# EAGLE design celly_jamjam (EAGLE 6.5.0)
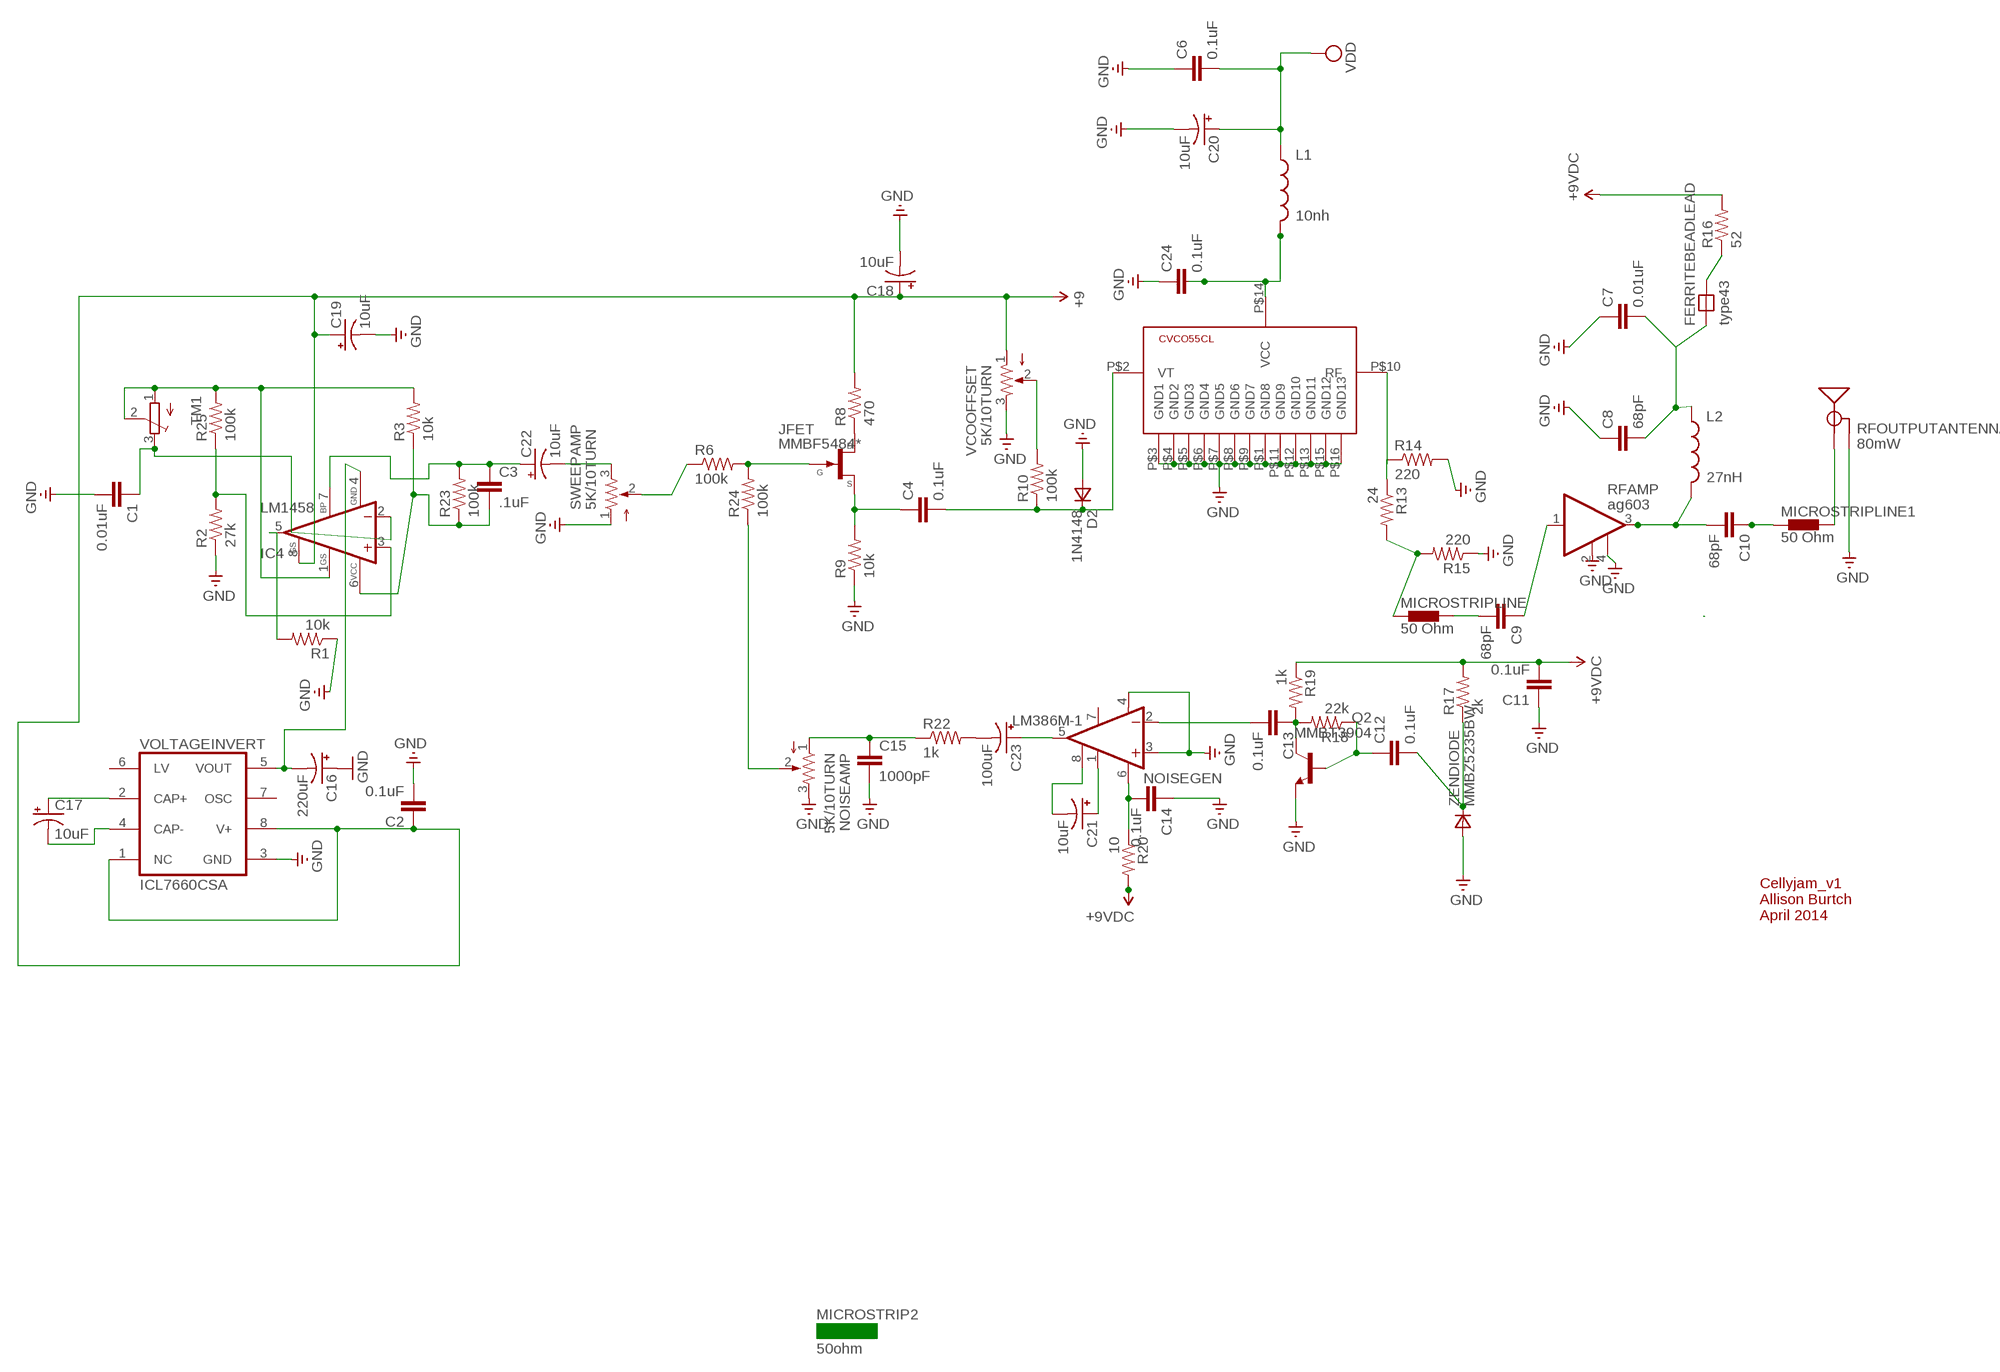
[diagram p0: schematic, sheet 1]

## Parts
C1  0.01uF  CAP0603-CAP  [0603-CAP]
C2  0.1uF  CAP0603-CAP  [0603-CAP]
C3  .1uF  CAP0603-CAP  [0603-CAP]
C4  0.1uF  CAP0603-CAP  [0603-CAP]
C6  0.1uF  CAP0603-CAP  [0603-CAP]
C7  0.01uF  CAP0603-CAP  [0603-CAP]
C8  68pF  CAP0603-CAP  [0603-CAP]
C9  68pF  CAP0603-CAP  [0603-CAP]
C10  68pF  CAP0603-CAP  [0603-CAP]
C11  0.1uF  CAP0603-CAP  [0603-CAP]
C12  0.1uF  CAP0603-CAP  [0603-CAP]
C13  0.1uF  CAP0603-CAP  [0603-CAP]
C14  0.1uF  CAP0603-CAP  [0603-CAP]
C15  1000pF  CAP0603-CAP  [0603-CAP]
C16  220uF  CAP_POLD  [PANASONIC_D]
C17  10uF  CAP_POLC  [PANASONIC_C]
C18  10uF  CAP_POLC  [PANASONIC_C]
C19  10uF  CAP_POLC  [PANASONIC_C]
C20  10uF  CAP_POLC  [PANASONIC_C]
C21  10uF  CAP_POLC  [PANASONIC_C]
C22  10uF  CAP_POLC  [PANASONIC_C]
C23  100uF  CAP_POLD  [PANASONIC_D]
C24  0.1uF  CAP0603-CAP  [0603-CAP]
D2  1N4148  DSOD323  [SOD323]
FERRITEBEADLEAD  type43  FB-226  [FB-226]
IC4  LM1458  LM386M  [SO08]
JFET  MMBF5484*  MMBF5484  [SOT23]
L1  10nh  INDUCTOR0603  [0603]
L2  27nH  INDUCTOR0603  [0603]
MICROSTRIPLINE  50 Ohm  BLM15HB121SN1  [0402]
MICROSTRIPLINE1  50 Ohm  BLM15HB121SN1  [0402]
NOISEAMP  5K/10TURN  P160KN  [P160KN]
NOISEGEN  LM386M-1  [SO08@1]
Q2  MMBT3904  [SOT23-BEC]
R1  10k  RESISTOR0603-RES  [0603-RES]
R2  27k  RESISTOR0603-RES  [0603-RES]
R3  10k  RESISTOR0603-RES  [0603-RES]
R6  100k  RESISTOR0603-RES  [0603-RES]
R8  470  RESISTOR0603-RES  [0603-RES]
R9  10k  RESISTOR0603-RES  [0603-RES]
R10  100k  RESISTOR0603-RES  [0603-RES]
R13  24  RESISTOR0603-RES  [0603-RES]
R14  220  RESISTOR0603-RES  [0603-RES]
R15  220  RESISTOR0603-RES  [0603-RES]
R16  52  RESISTOR0603-RES  [0603-RES]
R17  2k  RESISTOR0603-RES  [0603-RES]
R18  22k  RESISTOR0603-RES  [0603-RES]
R19  1k  RESISTOR0603-RES  [0603-RES]
R20  10  RESISTOR0603-RES  [0603-RES]
R22  1k  RESISTOR0603-RES  [0603-RES]
R23  100k  RESISTOR0603-RES  [0603-RES]
R24  100k  RESISTOR0603-RES  [0603-RES]
R25  100k  RESISTOR0603-RES  [0603-RES]
RFAMP  ag603  LEE-39+  [FG873]
RFOUTPUTANTENNA  80mW  ANTENNASMD1  [ANTENNA-CHIP]
SWEEPAMP  5K/10TURN  P160KN  [P160KN]
TM1  TRIMPOTTC33X  [TC33X]
U$1  CVCO55CL  [CVCO55CL]
VCOOFFSET  5K/10TURN  P160KN  [P160KN]
VOLTAGEINVERT  ICL7660CSA  [SO08]
ZENDIODE  MMBZ5235BW  DSOD323  [SOD323]

## Nets
GND: C1.2 C2.2 C6.1 C7.1 C8.1 C11.1 C14.1 C15.2 C16.+ C18.- C19.- C20.- C24.1 D2.2(A) NOISEAMP.3 NOISEGEN.3(+IN) NOISEGEN.4(GND) Q2.E R1.1 R2.1 R9.1 R14.2 R15.1 RFAMP.2(GND) RFAMP.4(GND) RFOUTPUTANTENNA.GND SWEEPAMP.1 U$1.P$1(GND8) U$1.P$3(GND1) U$1.P$4(GND2) U$1.P$5(GND3) U$1.P$6(GND4) U$1.P$7(GND5) U$1.P$8(GND6) U$1.P$9(GND7) U$1.P$11(GND9) U$1.P$12(GND10) U$1.P$13(GND11) U$1.P$15(GND12) U$1.P$16(GND13) VCOOFFSET.3 VOLTAGEINVERT.3(GND) ZENDIODE.2(A)
N$2: C7.2 C8.2 FERRITEBEADLEAD.1 L2.1
N$3: U$1.P$10(RF)
N$4: C17.+ VOLTAGEINVERT.2(CAP+)
N$5: C17.- VOLTAGEINVERT.4(CAP-)
N$6: C21.+ NOISEGEN.1(GAIN)
N$7: C16.- IC4.4(GND) VOLTAGEINVERT.5(VOUT)
N$8: IC4.1(GAIN) R3.2 R25.2 TM1.1(A) TM1.2(S)
N$10: C1.1 IC4.2(-IN) TM1.3(E)
N$11: R6.1 SWEEPAMP.2
N$12: C22.- SWEEPAMP.3
N$14: C3.2 IC4.6(VS) R3.1 R23.1
N$15: C21.- NOISEGEN.8(GAIN)
N$16: C12.1 Q2.B R18.1
N$17: C10.1 MICROSTRIPLINE1.1
N$18: C13.2 NOISEGEN.2(-IN)
N$19: C13.1 Q2.C R18.2 R19.2
N$20: C12.2 R17.1 ZENDIODE.1(C)
N$21: C23.- R22.2
N$22: C23.+ NOISEGEN.5(OUT)
N$23: C15.1 NOISEAMP.1 R22.1
N$24: C3.1 C22.+ IC4.7(BS2) R23.2
N$25: NOISEAMP.2 R24.1
N$26: C14.2 NOISEGEN.6(VS) R20.1
N$27: JFET.1(D) R8.1
N$28: MICROSTRIPLINE.1 R13.2 R15.2
N$29: R13.1 R14.1
N$30: C4.1 JFET.2(S) R9.2
N$31: R10.2 VCOOFFSET.2
N$32: C4.2 D2.1(C) R10.1 U$1.P$2(VT)
N$33: C9.1 RFAMP.1(IN)
N$34: C10.2 L2.2 RFAMP.3(OUT)
N$35: C9.2 MICROSTRIPLINE.2
N$36: FERRITEBEADLEAD.2 R16.1
N$37: C24.2 L1.2 U$1.P$14(VCC)
N$40: MICROSTRIPLINE1.2 RFOUTPUTANTENNA.FEED(SIGNAL)
N$47: JFET.3(G) R6.2 R24.2
N$48: IC4.5(OUT) R1.2
N$49: IC4.3(+IN) R2.2 R25.1
VCC: C2.1 C11.2 C18.+ C19.+ IC4.8(GAIN) R8.2 R16.2 R17.2 R19.1 R20.2 VCOOFFSET.1 VOLTAGEINVERT.1(NC) VOLTAGEINVERT.8(V+) ; supply symbol labelled +9VDC, +9
VDD: C6.2 C20.+ L1.1
Unconnected: NOISEGEN.7(BYPASS) VOLTAGEINVERT.6(LV) VOLTAGEINVERT.7(OSC)

## Notes on the sheet
- Cellyjam_v1
  Allison Burtch 
  April 2014

## Library data of the parts
C1-C4 C6-C15 C24 = SparkFun-Passives:CAP: Capacitor Standard 0603 ceramic capacitor, and 0.1" leaded capacitor.
C16-C23 = SparkFun-Capacitors:CAP_POL: Capacitor Polarized These are standard SMD and PTH capacitors. Normally 10uF, 47uF, and 100uF in electrolytic and tantalum varieties. Always verify the external diameter of the through hole cap, it varies with capacity, voltage, and manufacturer. The EIA devices should be standard.
D2 ZENDIODE = zetex:D: DIODE; MPN: CDSOD323-T05C; OC_FARNELL: 1824860; OC_NEWARK: 79R6078
FERRITEBEADLEAD = inductor-jwmiller:FB: FERRITE BEAD
IC4 = linear:LM386: Low Voltage Audio Power Amplifier
JFET = transistor-fet:MMBF5484*: N-Channel JFET
L1 L2 = SparkFun-Passives:INDUCTOR: Inductors Basic Inductor/Choke - 0603 and 1206. Footprints are not proven and vary greatly between part numbers. SRN6045- 33uH, 20% 1.4A SDR0403-560KL - 56uH, 10%, 500mA RMS/740mA peak
MICROSTRIPLINE MICROSTRIPLINE1 = inductors:BLM15H: EMIFIL (R) Chip Ferrite Bead for GHz Noise Source: http://www.murata.com/ Ferrite Bead BLM15H.pdf
NOISEAMP SWEEPAMP VCOOFFSET = pot:P160KN: POTENTIOMETER - 11 mm 6 mm shaft, 18 teeth knurl
NOISEGEN = linear:LM386?-*: Low Voltage Audio Power Amplifier Source: http://cache.national.com/ds/LM/LM386.pdf
Q2 = transistor-npn:MMBT3904*: NPN TRANSISTOR
R1-R3 R6 R8-R10 R13-R20 R22-R25 = SparkFun-Resistors:RESISTOR: Resistor Basic schematic elements and footprints for 0603, 1206, and PTH resistors.
RFAMP = mini-circuits:LEE-39+: Monolithic RF Amplifier
RFOUTPUTANTENNA = SparkFun-RF:ANTENNA: Chip antenna Chip antenna with ground or secondary connection. Common with larger metal RF connectors.
TM1 = adafruit:TRIMPOT: SMT trimmer potentiometer part number TC33X http://www.ladyada.net/library/eagle
U$1 = crystec_vco:CVCO55CL: Volatage Controlled Oscillator - VCO Vendor: CRYSTEK MICROWAVE Series: CVCO-55CL
VOLTAGEINVERT = maxim:ICL7660CSA: VOLTAGE CONVERTER; MF: MAXIM; MPN: ICL7660CSA; OC_FARNELL: 9724710; OC_NEWARK: 34C3732

## Board
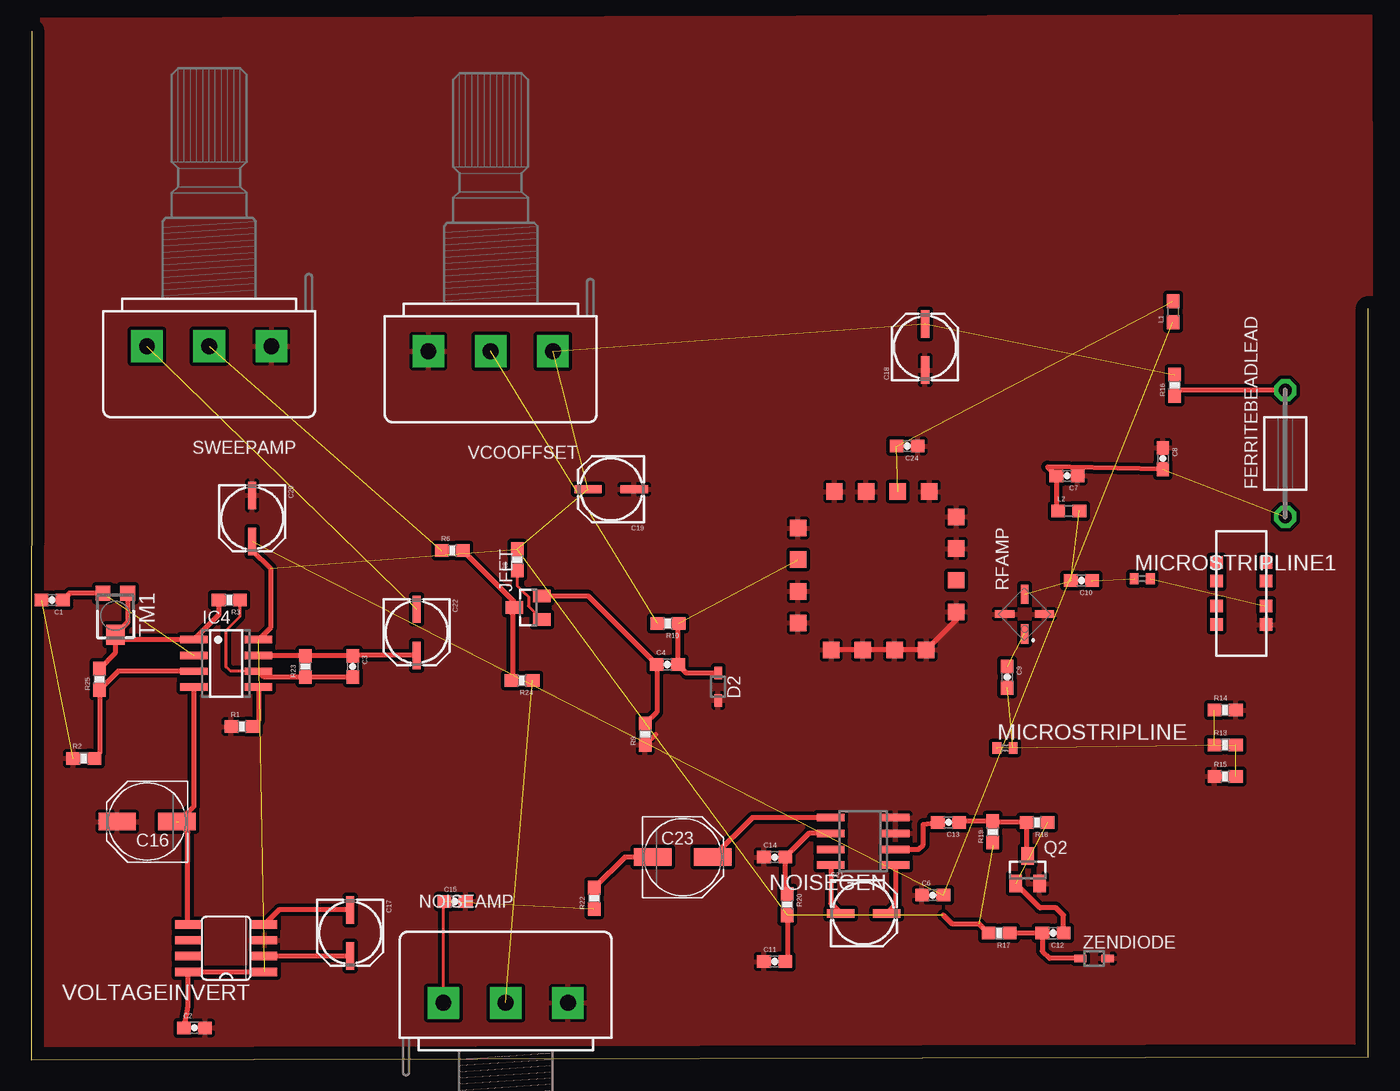
[diagram p1: board, top side]
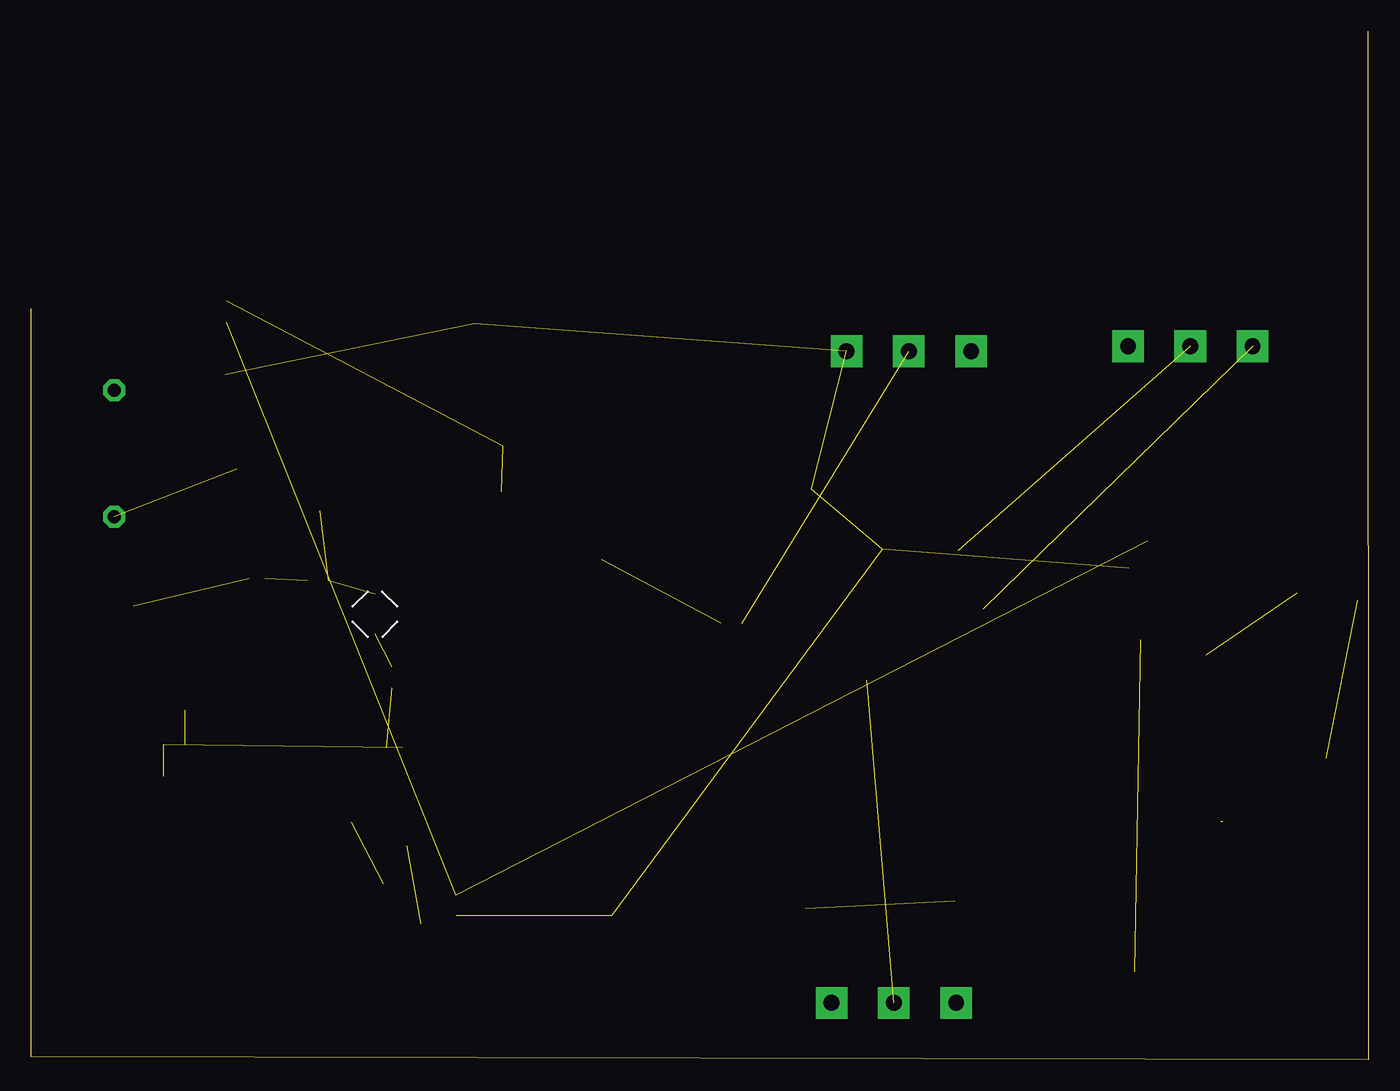
[diagram p2: board, bottom side, seen from below]

Size 107.37 x 82.55 mm. Coordinates in mm from the lower left corner, seen from the top.
Outline: 107.37,60.25 107.37,0.25 0,0 0.05,82.55
Copper layers (1*16): Top 0.035mm / dielectric 1.5mm / Bottom 0.035mm
Design rules "default": minimum track width 10mil, minimum drill 24mil, track to track 8mil, track to pad 8mil, pad to pad 8mil, via to via 8mil, smd to smd 8mil, copper to edge 40mil, drill to drill 8mil, minimum pad ring 10mil, minimum via ring 8mil, stop-mask expansion 4mil, vias tented up to drill 0mil, thermal gap 10mil

### Footprints (pad centres in the part's own frame; a part is rotated, then mirrored left to right if it is on the bottom)
0603-CAP = smd 1.1 x 1: 1 -0.85,0; 2 0.85,0
PANASONIC_D = smd 3 x 1.4: + 2.4,0; - -2.4,0
PANASONIC_C = smd 2.2 x 0.65: + 1.9,-0.2; - -1.8,-0.2
SOD323 = smd 1 x 0.6: 1 -1.1,0; 2 1.1,0
FB-226 = drill 1.016 pad 1.778 octagon: 1 -5.08,0; 2 5.08,0
SO08 = smd 0.6 x 2.2: 1 -1.905,-2.6; 2 -0.635,-2.6; 3 0.635,-2.6; 4 1.905,-2.6; 5 1.905,2.6; 6 0.635,2.6; 7 -0.635,2.6; 8 -1.905,2.6
SOT23 = smd 1 x 1.4: 1 -0.95,-1.1; 2 0.95,-1.1; 3 0,1.1
0603 = smd 1.1 x 1: 1 -0.85,0; 2 0.85,0
0402 = smd 0.7 x 0.9: 1 -0.65,0; 2 0.65,0
P160KN = drill 1.27 pad 2.54 square: 1 -3.8,-5; 2 -3.8,0; 3 -3.8,5
SO08@1 = smd 0.6 x 2.2: 1 -1.905,-2.6; 2 -0.635,-2.6; 3 0.635,-2.6; 4 1.905,-2.6; 5 1.905,2.6; 6 0.635,2.6; 7 -0.635,2.6; 8 -1.905,2.6
SOT23-BEC = smd 1 x 1.4: B -0.95,-1.1; C 0,1.1; E 0.95,-1.1
0603-RES = smd 1.1 x 1: 1 -0.85,0; 2 0.85,0
FG873 = smd 1.549 x 0.61: 1 -1.587,0; 3 1.587,0 | smd 0.61 x 1.549: 2 0,-1.587; 4 0,1.587
ANTENNA-CHIP = smd 1 x 1: 3 1,-2; 4 2.5,-2; 5 2.5,2; 6 1,2; 7 -1,2; 8 -2.5,2; FEED -1,-2; GND -2.5,-2
TC33X = smd 1.2 x 1.2: 1 -1,-1.825; 3 1,-1.825 | smd 1.5 x 1.6: 2 0,1.5
CVCO55CL = smd 1.32 x 1.32: P$1 2.921,0; P$2 5.461,0; P$3 8.001,0; P$4 10.541,0; P$5 12.7,2.667; P$6 12.7,5.207; P$7 12.7,7.747; P$8 12.7,10.287; P$9 9.652,12.7; P$10 7.112,12.7; P$11 4.572,12.7; P$12 2.032,12.7; P$13 0,10.541; P$14 0,8.001; P$15 0,5.461; P$16 0,2.921
SO08' = smd 0.66 x 2.032: 1 -1.905,-3.073; 2 -0.635,-3.073; 3 0.635,-3.073; 4 1.905,-3.073; 5 1.905,3.073; 6 0.635,3.073; 7 -0.635,3.073; 8 -1.905,3.073

### Placement (x,y rotation side)
C1  1.69,36.89 180 top
C2  13.11,2.56 0 top
C3  25.82,31.56 270 top
C4  51.09,31.71 0 top
C6  72.39,13.21 0 top
C7  83.17,46.86 180 top
C8  90.86,48.25 270 top
C9  78.37,30.71 270 top
C10  84.33,38.46 180 top
C11  59.69,7.87 0 top
C12  82.04,10.16 180 top
C13  73.66,19.05 180 top
C14  59.69,16.26 0 top
C15  34.04,12.7 0 top
C16  9.31,19.11 180 top
C17  25.82,10.22 270 top
C18  71.58,57.15 90 top
C19  46.62,45.58 180 top
C20  17.94,43.5 270 top
C21  66.8,11.94 0 top
C22  31.15,34.35 270 top
C23  52.32,16.26 0 top
C24  70.34,49.25 180 top
D2  55.15,29.94 270 top
FERRITEBEADLEAD  100.69,48.65 90 top
IC4  15.66,31.81 270 top
JFET  39.91,36.29 90 top
L1  91.68,60.03 90 top
L2  83.32,44.04 0 top
MICROSTRIPLINE  78.19,25.02 0 top
MICROSTRIPLINE1  89.21,38.61 0 top
NOISEAMP  38.1,0.76 270 top
NOISEGEN  66.8,17.53 90 top
Q2  80.01,15.24 0 top
R1  16.93,26.73 0 top
R2  4.23,24.19 0 top
R3  15.91,36.89 180 top
R6  33.81,40.86 0 top
R8  39.02,40.12 90 top
R9  49.31,26.13 90 top
R10  51.14,35.02 180 top
R13  95.87,25.27 0 top
R14  95.87,28.07 0 top
R15  95.87,22.73 0 top
R16  91.8,54.14 90 top
R17  77.72,10.16 180 top
R18  80.77,19.05 180 top
R19  77.22,18.29 90 top
R20  60.71,12.45 270 top
R22  45.21,12.95 90 top
R23  22.01,31.56 90 top
R24  39.4,30.44 180 top
R25  5.5,30.54 90 top
RFAMP  79.76,35.76 90 top
RFOUTPUTANTENNA  97.16,37.42 90 top
SWEEPAMP  14.3,61.06 90 top
TM1  6.77,35.62 180 top
U$1  61.58,45.59 270 top
VCOOFFSET  36.9,60.66 90 top
VOLTAGEINVERT  ICL7660CSA  [SO08']  15.66,8.95 90 top
ZENDIODE  85.34,8.13 0 top

### Tracks (layer width: path | path; a pad name or v marks a point on that pad's centre or on a via)
GND  (1 unrouted)
  Top 0.406: 61.32,34.67 61.58,34.93 U$1.P$4 61.55,35.05 61.4,34.9 | 50.13,26.1 R9.1 | 55.19,28.79 D2.2 | U$1.P$9 74.28,35.31 U$1.P$8 U$1.P$7 U$1.P$6 U$1.P$5
  pour Top (isolate 0.305): 0.05,83.46 107.5,83.76 107.7,-1.02 -0.25,-1.02 -0.25,0.25
N$2  (1 unrouted)
  Top 0.406: C8.2 81.6,47.58 C7.2 82.32,44.2 L2.1
N$4
  Top 0.406: C17.+ VOLTAGEINVERT.2
N$5
  Top 0.406: C17.- 19.89,12.02 VOLTAGEINVERT.4
N$6
  Top 0.406: NOISEGEN.1 69.4,12.44 C21.+
N$7  (1 unrouted)
  Top 0.406: VOLTAGEINVERT.5 12.58,18.24 C16.- | IC4.4 13.06,20.32 11.85,19.11
N$8
  Top 0.406: TM1.2 6.77,32.66 R25.2 | TM1.2 7.17,33.72 IC4.1 15.06,35.72 R3.2 | TM1.1 7.77,35.12 TM1.2
N$10  (1 unrouted)
  Top 0.406: TM1.3 3.09,37.45 C1.1
N$11  (1 unrouted)
N$12  (1 unrouted)
N$14
  Top 0.254: R3.1 16.76,35.56 15.66,34.46 15.66,31.54 16.01,31.18 IC4.6
  Top 0.406: IC4.6 18.72,30.71 R23.1 C3.2
N$15
  Top 0.406: NOISEGEN.8 64.2,12.54 C21.-
N$16  (1 unrouted)
  Top 0.406: C12.1 82.89,11.6 82.3,12.19 81.01,12.19 Q2.B
N$17  (1 unrouted)
N$18
  Top 0.406: NOISEGEN.2 71.25,16.89 71.63,17.27 71.63,18.88 C13.2
N$19
  Top 0.406: C13.1 74.6,19.14 R19.2 77.3,19.05 R18.2 79.92,16.43 Q2.C
N$20
  Top 0.406: R17.1 C12.2 81.19,8.72 81.79,8.13 ZENDIODE.1
N$21
  Top 0.406: C23.- 47.66,16.26 R22.2
N$22
  Top 0.406: NOISEGEN.5 57.9,19.43 C23.+
N$23  (1 unrouted)
  Top 0.254: NOISEAMP.1 33.1,12.61 C15.1
N$24
  Top 0.406: IC4.7 18.29,32.41 R23.2 C3.1 25.86,32.45 C22.+
N$25  (1 unrouted)
N$26
  Top 0.406: NOISEGEN.6 62.45,18.16 C14.2 60.54,13.46 R20.1
N$27
  Top 0.254: R8.1 39.02,38.04 39.71,37.35 39.76,37.35 39.94,37.17 39.94,36.41 JFET.1
N$28  (2 unrouted)
N$29  (1 unrouted)
N$30
  Top 0.406: R9.2 50.24,27.9 C4.1 44.71,37.24 JFET.2
N$31  (1 unrouted)
N$32  (1 unrouted)
  Top 0.406: D2.1 52.61,31.04 C4.2 51.94,34.96 R10.1
N$33  (1 unrouted)
N$34  (2 unrouted)
N$35  (1 unrouted)
N$36
  Top 0.406: FERRITEBEADLEAD.2 92.25,53.73 R16.1
N$37  (2 unrouted)
N$40  (1 unrouted)
N$47
  Top 0.406: R24.2 38.64,30.53 38.64,35.78 38.39,36.03 38.64,36.29 JFET.3 38.81,36.71 R6.2
N$48
  Top 0.406: IC4.5 18.26,27.21 R1.2
N$49
  Top 0.406: IC4.3 6.98,31.18 R25.1 5.5,24.61 R2.2
VCC  (9 unrouted)
  Top 0.406: VOLTAGEINVERT.1 VOLTAGEINVERT.8 12.58,4.29 C2.1 | 17.74,40.9 19.21,39.43 19.21,34.67 IC4.8 | R20.2 60.71,8.04 C11.2 | R19.1 77.22,17.18 | 73.24,11.6 73.91,10.92 76.11,10.92 R17.2
VDD  (2 unrouted)